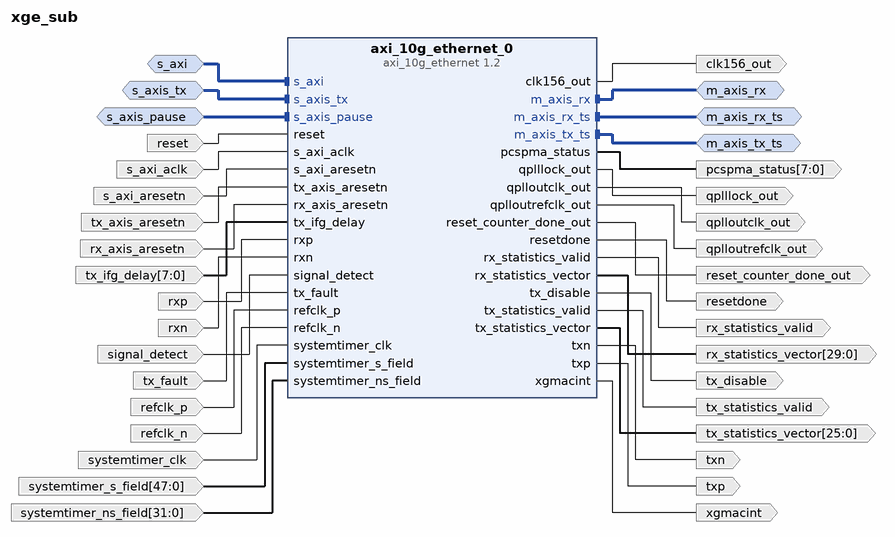
[diagram p0: block diagram of the top level]
# Vivado block design xge_sub, Vivado 2014.2
create_bd_design xge_sub

create_bd_intf_port -mode Slave -vlnv xilinx.com:interface:aximm_rtl:1.0 s_axi
set_property -dict [list \
  CONFIG.DATA_WIDTH 32 \
  CONFIG.PROTOCOL AXI4LITE \
  CONFIG.FREQ_HZ 100000000 \
  CONFIG.ID_WIDTH 0 \
  CONFIG.ADDR_WIDTH 32 \
  CONFIG.AWUSER_WIDTH 0 \
  CONFIG.ARUSER_WIDTH 0 \
  CONFIG.WUSER_WIDTH 0 \
  CONFIG.RUSER_WIDTH 0 \
  CONFIG.BUSER_WIDTH 0 \
  CONFIG.READ_WRITE_MODE READ_WRITE \
  CONFIG.SUPPORTS_NARROW_BURST 0 \
  CONFIG.NUM_READ_OUTSTANDING 1 \
  CONFIG.NUM_WRITE_OUTSTANDING 1 \
  CONFIG.MAX_BURST_LENGTH 1 \
  CONFIG.PHASE 0.000 \
] [get_bd_intf_ports s_axi]
create_bd_intf_port -mode Slave -vlnv xilinx.com:interface:axis_rtl:1.0 s_axis_tx
set_property -dict [list \
  CONFIG.TDATA_NUM_BYTES 8 \
  CONFIG.TDEST_WIDTH 0 \
  CONFIG.TID_WIDTH 0 \
  CONFIG.TUSER_WIDTH 128 \
  CONFIG.HAS_TREADY 1 \
  CONFIG.HAS_TSTRB 0 \
  CONFIG.HAS_TKEEP 1 \
  CONFIG.HAS_TLAST 1 \
  CONFIG.PHASE 0.000 \
  CONFIG.LAYERED_METADATA undef \
] [get_bd_intf_ports s_axis_tx]
create_bd_intf_port -mode Slave -vlnv xilinx.com:interface:axis_rtl:1.0 s_axis_pause
set_property -dict [list \
  CONFIG.TDATA_NUM_BYTES 2 \
  CONFIG.TDEST_WIDTH 0 \
  CONFIG.TID_WIDTH 0 \
  CONFIG.TUSER_WIDTH 0 \
  CONFIG.HAS_TREADY 0 \
  CONFIG.HAS_TSTRB 0 \
  CONFIG.HAS_TKEEP 0 \
  CONFIG.HAS_TLAST 0 \
  CONFIG.PHASE 0.000 \
  CONFIG.LAYERED_METADATA undef \
] [get_bd_intf_ports s_axis_pause]
create_bd_intf_port -mode Master -vlnv xilinx.com:interface:axis_rtl:1.0 m_axis_rx
create_bd_intf_port -mode Master -vlnv xilinx.com:interface:axis_rtl:1.0 m_axis_tx_ts
create_bd_intf_port -mode Master -vlnv xilinx.com:interface:axis_rtl:1.0 m_axis_rx_ts
create_bd_port -dir I -type rst reset
set_property -dict {CONFIG.POLARITY ACTIVE_HIGH} [get_bd_ports reset]
create_bd_port -dir I -type clk s_axi_aclk
set_property -dict {CONFIG.ASSOCIATED_BUSIF s_axi} [get_bd_ports s_axi_aclk]
create_bd_port -dir I -type rst s_axi_aresetn
create_bd_port -dir I -type rst tx_axis_aresetn
create_bd_port -dir I -type rst rx_axis_aresetn
create_bd_port -dir I -from 7 -to 0 tx_ifg_delay
create_bd_port -dir I rxp
create_bd_port -dir I rxn
create_bd_port -dir I signal_detect
create_bd_port -dir I tx_fault
create_bd_port -dir I refclk_p
create_bd_port -dir I refclk_n
create_bd_port -dir I -type clk systemtimer_clk
create_bd_port -dir I -from 47 -to 0 systemtimer_s_field
create_bd_port -dir I -from 31 -to 0 systemtimer_ns_field
create_bd_port -dir O -type clk clk156_out
set_property -dict {CONFIG.ASSOCIATED_BUSIF s_axis_tx:s_axis_pause:m_axis_rx:m_axis_tx_ts:m_axis_rx_ts} [get_bd_ports clk156_out]
create_bd_port -dir O -type intr xgmacint
create_bd_port -dir O -from 25 -to 0 tx_statistics_vector
create_bd_port -dir O tx_statistics_valid
create_bd_port -dir O -from 29 -to 0 rx_statistics_vector
create_bd_port -dir O rx_statistics_valid
create_bd_port -dir O txp
create_bd_port -dir O txn
create_bd_port -dir O tx_disable
create_bd_port -dir O -from 7 -to 0 pcspma_status
create_bd_port -dir O resetdone
create_bd_port -dir O reset_counter_done_out
create_bd_port -dir O qplllock_out
create_bd_port -dir O qplloutclk_out
create_bd_port -dir O qplloutrefclk_out

create_bd_cell -type ip -vlnv xilinx.com:ip:axi_10g_ethernet:1.2 axi_10g_ethernet_0
set_property -dict {CONFIG.TIMER_CLK_PERIOD 4000 CONFIG.Statistics_Gathering false} [get_bd_cells axi_10g_ethernet_0]

# ---- connections ----

connect_bd_intf_net [get_bd_intf_ports s_axi] [get_bd_intf_pins axi_10g_ethernet_0/s_axi]
connect_bd_intf_net [get_bd_intf_ports s_axis_tx] [get_bd_intf_pins axi_10g_ethernet_0/s_axis_tx]
connect_bd_intf_net [get_bd_intf_ports s_axis_pause] [get_bd_intf_pins axi_10g_ethernet_0/s_axis_pause]
connect_bd_intf_net [get_bd_intf_ports m_axis_rx] [get_bd_intf_pins axi_10g_ethernet_0/m_axis_rx]
connect_bd_intf_net [get_bd_intf_ports m_axis_tx_ts] [get_bd_intf_pins axi_10g_ethernet_0/m_axis_tx_ts]
connect_bd_intf_net [get_bd_intf_ports m_axis_rx_ts] [get_bd_intf_pins axi_10g_ethernet_0/m_axis_rx_ts]
connect_bd_net [get_bd_ports reset] [get_bd_pins axi_10g_ethernet_0/reset]
connect_bd_net [get_bd_ports s_axi_aclk] [get_bd_pins axi_10g_ethernet_0/s_axi_aclk]
connect_bd_net [get_bd_ports s_axi_aresetn] [get_bd_pins axi_10g_ethernet_0/s_axi_aresetn]
connect_bd_net [get_bd_ports tx_axis_aresetn] [get_bd_pins axi_10g_ethernet_0/tx_axis_aresetn]
connect_bd_net [get_bd_ports rx_axis_aresetn] [get_bd_pins axi_10g_ethernet_0/rx_axis_aresetn]
connect_bd_net [get_bd_ports tx_ifg_delay] [get_bd_pins axi_10g_ethernet_0/tx_ifg_delay]
connect_bd_net [get_bd_ports rxp] [get_bd_pins axi_10g_ethernet_0/rxp]
connect_bd_net [get_bd_ports rxn] [get_bd_pins axi_10g_ethernet_0/rxn]
connect_bd_net [get_bd_ports signal_detect] [get_bd_pins axi_10g_ethernet_0/signal_detect]
connect_bd_net [get_bd_ports tx_fault] [get_bd_pins axi_10g_ethernet_0/tx_fault]
connect_bd_net [get_bd_ports refclk_p] [get_bd_pins axi_10g_ethernet_0/refclk_p]
connect_bd_net [get_bd_ports refclk_n] [get_bd_pins axi_10g_ethernet_0/refclk_n]
connect_bd_net [get_bd_ports systemtimer_clk] [get_bd_pins axi_10g_ethernet_0/systemtimer_clk]
connect_bd_net [get_bd_ports systemtimer_s_field] [get_bd_pins axi_10g_ethernet_0/systemtimer_s_field]
connect_bd_net [get_bd_ports systemtimer_ns_field] [get_bd_pins axi_10g_ethernet_0/systemtimer_ns_field]
connect_bd_net [get_bd_pins axi_10g_ethernet_0/clk156_out] [get_bd_ports clk156_out]
connect_bd_net [get_bd_pins axi_10g_ethernet_0/xgmacint] [get_bd_ports xgmacint]
connect_bd_net [get_bd_pins axi_10g_ethernet_0/tx_statistics_vector] [get_bd_ports tx_statistics_vector]
connect_bd_net [get_bd_pins axi_10g_ethernet_0/tx_statistics_valid] [get_bd_ports tx_statistics_valid]
connect_bd_net [get_bd_pins axi_10g_ethernet_0/rx_statistics_vector] [get_bd_ports rx_statistics_vector]
connect_bd_net [get_bd_pins axi_10g_ethernet_0/rx_statistics_valid] [get_bd_ports rx_statistics_valid]
connect_bd_net [get_bd_pins axi_10g_ethernet_0/txp] [get_bd_ports txp]
connect_bd_net [get_bd_pins axi_10g_ethernet_0/txn] [get_bd_ports txn]
connect_bd_net [get_bd_pins axi_10g_ethernet_0/tx_disable] [get_bd_ports tx_disable]
connect_bd_net [get_bd_pins axi_10g_ethernet_0/pcspma_status] [get_bd_ports pcspma_status]
connect_bd_net [get_bd_pins axi_10g_ethernet_0/resetdone] [get_bd_ports resetdone]
connect_bd_net [get_bd_pins axi_10g_ethernet_0/reset_counter_done_out] [get_bd_ports reset_counter_done_out]
connect_bd_net [get_bd_pins axi_10g_ethernet_0/qplllock_out] [get_bd_ports qplllock_out]
connect_bd_net [get_bd_pins axi_10g_ethernet_0/qplloutclk_out] [get_bd_ports qplloutclk_out]
connect_bd_net [get_bd_pins axi_10g_ethernet_0/qplloutrefclk_out] [get_bd_ports qplloutrefclk_out]

# ---- address map ----
assign_bd_address -offset 0x00060000 -range 64K -target_address_space [get_bd_addr_spaces s_axi] [get_bd_addr_segs axi_10g_ethernet_0/ten_gig_eth_mac/s_axi/Reg]

validate_bd_design
save_bd_design
